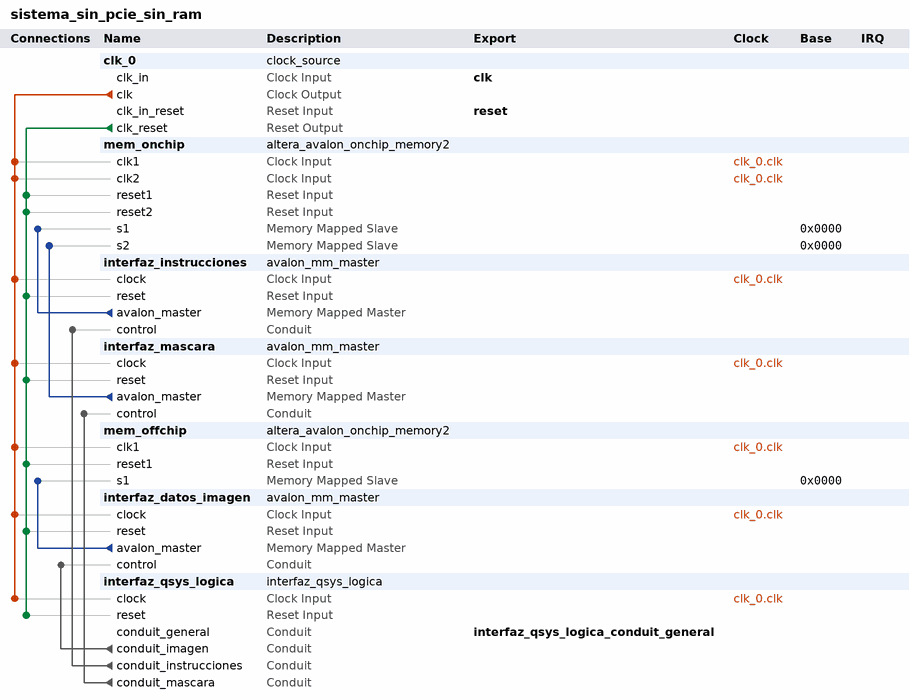
[diagram p0: system contents]
# Platform Designer (Qsys) system sistema_sin_pcie_sin_ram, Cyclone IV GX EP4CGX150DF31C7
# Parameters at their usual value, and those the tool derives, are not listed.
package require -exact qsys 15.1
create_system sistema_sin_pcie_sin_ram
set_project_property DEVICE_FAMILY {Cyclone IV GX}
set_project_property DEVICE EP4CGX150DF31C7

add_instance clk_0 clock_source 15.1
set_instance_parameter_value clk_0 clockFrequency 50000000

add_instance mem_onchip altera_avalon_onchip_memory2 15.1
set_instance_parameter_value mem_onchip dataWidth 32
set_instance_parameter_value mem_onchip dualPort true
set_instance_parameter_value mem_onchip initMemContent true
set_instance_parameter_value mem_onchip initializationFileName {C:/Users/Mauricio Paz/Documents/GitHub/ArquitecturaFiltros/prueba3/memoria_interna.hex}
set_instance_parameter_value mem_onchip memorySize 4096
set_instance_parameter_value mem_onchip useNonDefaultInitFile true

add_instance interfaz_instrucciones avalon_mm_master 1.0
set_instance_parameter_value interfaz_instrucciones ADDRESS_BITS 12
set_instance_parameter_value interfaz_instrucciones DATA_BITS 32

add_instance interfaz_mascara avalon_mm_master 1.0
set_instance_parameter_value interfaz_mascara ADDRESS_BITS 12
set_instance_parameter_value interfaz_mascara DATA_BITS 32

add_instance mem_offchip altera_avalon_onchip_memory2 15.1
set_instance_parameter_value mem_offchip dataWidth 32
set_instance_parameter_value mem_offchip dualPort false
set_instance_parameter_value mem_offchip initMemContent true
set_instance_parameter_value mem_offchip initializationFileName {C:/Users/Mauricio Paz/Documents/GitHub/ArquitecturaFiltros/prueba3/memoria_ram.mif}
set_instance_parameter_value mem_offchip memorySize 65536
set_instance_parameter_value mem_offchip useNonDefaultInitFile true

add_instance interfaz_datos_imagen avalon_mm_master 1.0
set_instance_parameter_value interfaz_datos_imagen ADDRESS_BITS 16
set_instance_parameter_value interfaz_datos_imagen DATA_BITS 32

add_instance interfaz_qsys_logica interfaz_qsys_logica 1.0
set_instance_parameter_value interfaz_qsys_logica BITS_ADDR_MEM_OFFCHIP 16
set_instance_parameter_value interfaz_qsys_logica BITS_ADDR_MEM_ONCHIP 12
set_instance_parameter_value interfaz_qsys_logica BITS_BUS_DATOS_INSTR 24
set_instance_parameter_value interfaz_qsys_logica BITS_BUS_DIRECCION_INSTR 8
set_instance_parameter_value interfaz_qsys_logica BITS_MEMORY_DATA 32

# connections
add_connection clk_0.clk interfaz_datos_imagen.clock clock
add_connection clk_0.clk interfaz_instrucciones.clock clock
add_connection clk_0.clk interfaz_mascara.clock clock
add_connection clk_0.clk interfaz_qsys_logica.clock clock
add_connection clk_0.clk mem_offchip.clk1 clock
add_connection clk_0.clk mem_onchip.clk1 clock
add_connection clk_0.clk mem_onchip.clk2 clock
add_connection clk_0.clk_reset interfaz_datos_imagen.reset reset
add_connection clk_0.clk_reset interfaz_instrucciones.reset reset
add_connection clk_0.clk_reset interfaz_mascara.reset reset
add_connection clk_0.clk_reset interfaz_qsys_logica.reset reset
add_connection clk_0.clk_reset mem_offchip.reset1 reset
add_connection clk_0.clk_reset mem_onchip.reset1 reset
add_connection clk_0.clk_reset mem_onchip.reset2 reset
add_connection interfaz_datos_imagen.avalon_master mem_offchip.s1 avalon
set_connection_parameter_value interfaz_datos_imagen.avalon_master/mem_offchip.s1 baseAddress 0x0000
add_connection interfaz_instrucciones.avalon_master mem_onchip.s1 avalon
set_connection_parameter_value interfaz_instrucciones.avalon_master/mem_onchip.s1 baseAddress 0x0000
add_connection interfaz_mascara.avalon_master mem_onchip.s2 avalon
set_connection_parameter_value interfaz_mascara.avalon_master/mem_onchip.s2 baseAddress 0x0000
add_connection interfaz_qsys_logica.conduit_imagen interfaz_datos_imagen.control conduit
add_connection interfaz_qsys_logica.conduit_instrucciones interfaz_instrucciones.control conduit
add_connection interfaz_qsys_logica.conduit_mascara interfaz_mascara.control conduit

# exported interfaces
add_interface clk clock sink
set_interface_property clk EXPORT_OF clk_0.clk_in
add_interface interfaz_qsys_logica_conduit_general conduit end
set_interface_property interfaz_qsys_logica_conduit_general EXPORT_OF interfaz_qsys_logica.conduit_general
add_interface reset reset sink
set_interface_property reset EXPORT_OF clk_0.clk_in_reset

set_interconnect_requirement {$system} qsys_mm.clockCrossingAdapter HANDSHAKE
set_interconnect_requirement {$system} qsys_mm.enableEccProtection FALSE
set_interconnect_requirement {$system} qsys_mm.insertDefaultSlave FALSE
set_interconnect_requirement {$system} qsys_mm.maxAdditionalLatency 1

save_system sistema_sin_pcie_sin_ram.qsys
